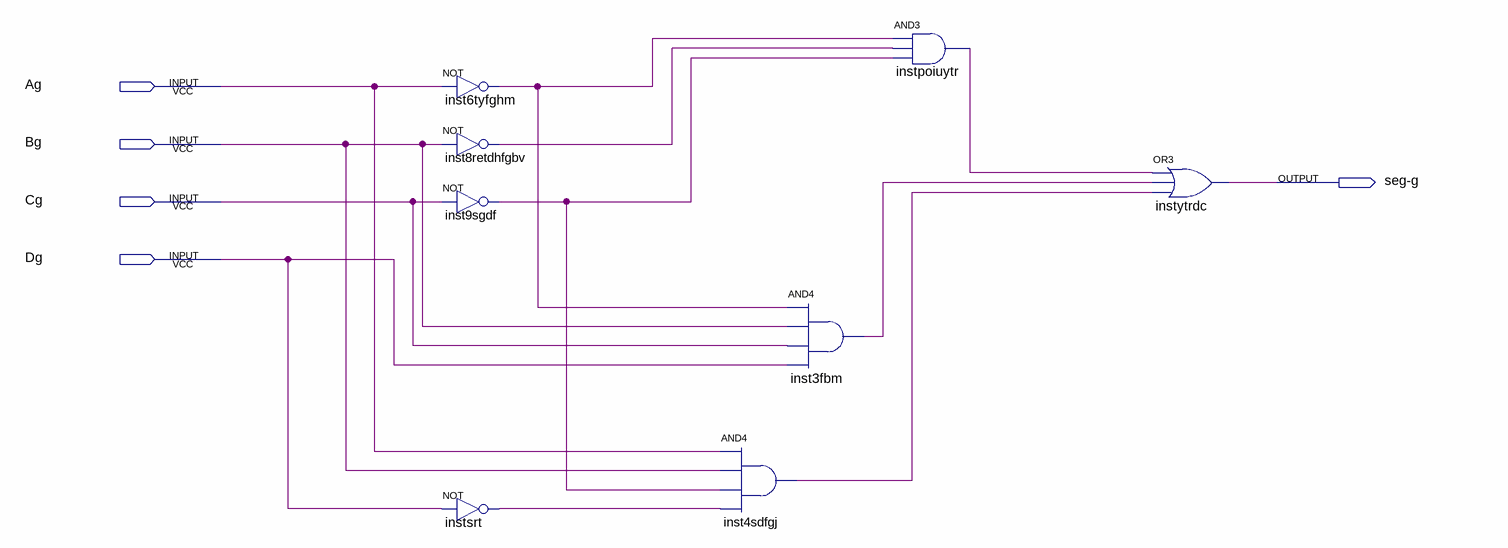
[diagram p0: schematic sheet]
// Quartus schematic segmento_g.bdf as structural Verilog: 8 symbols, 5 pins
module segmento_g (
  input  Ag,
  input  Bg,
  input  Cg,
  input  Dg,
  output \seg-g 
);

  wire inst3fbm_out, inst4sdfgj_out, inst6tyfghm_out, inst8retdhfgbv_out, inst9sgdf_out, instpoiuytr_out,
       instsrt_out;

  not inst6tyfghm (inst6tyfghm_out, Ag);
  not inst8retdhfgbv (inst8retdhfgbv_out, Bg);
  not inst9sgdf (inst9sgdf_out, Cg);
  not instsrt (instsrt_out, Dg);
  and inst4sdfgj (inst4sdfgj_out, Ag, Bg, inst9sgdf_out, instsrt_out);
  and inst3fbm (inst3fbm_out, inst6tyfghm_out, Bg, Cg, Dg);
  and instpoiuytr (instpoiuytr_out, inst6tyfghm_out, inst8retdhfgbv_out, inst9sgdf_out);
  or instytrdc (\seg-g , instpoiuytr_out, inst3fbm_out, inst4sdfgj_out);
endmodule
